# Altium project pay-optical-tls2591.PrjPCB (part 1 of 2)
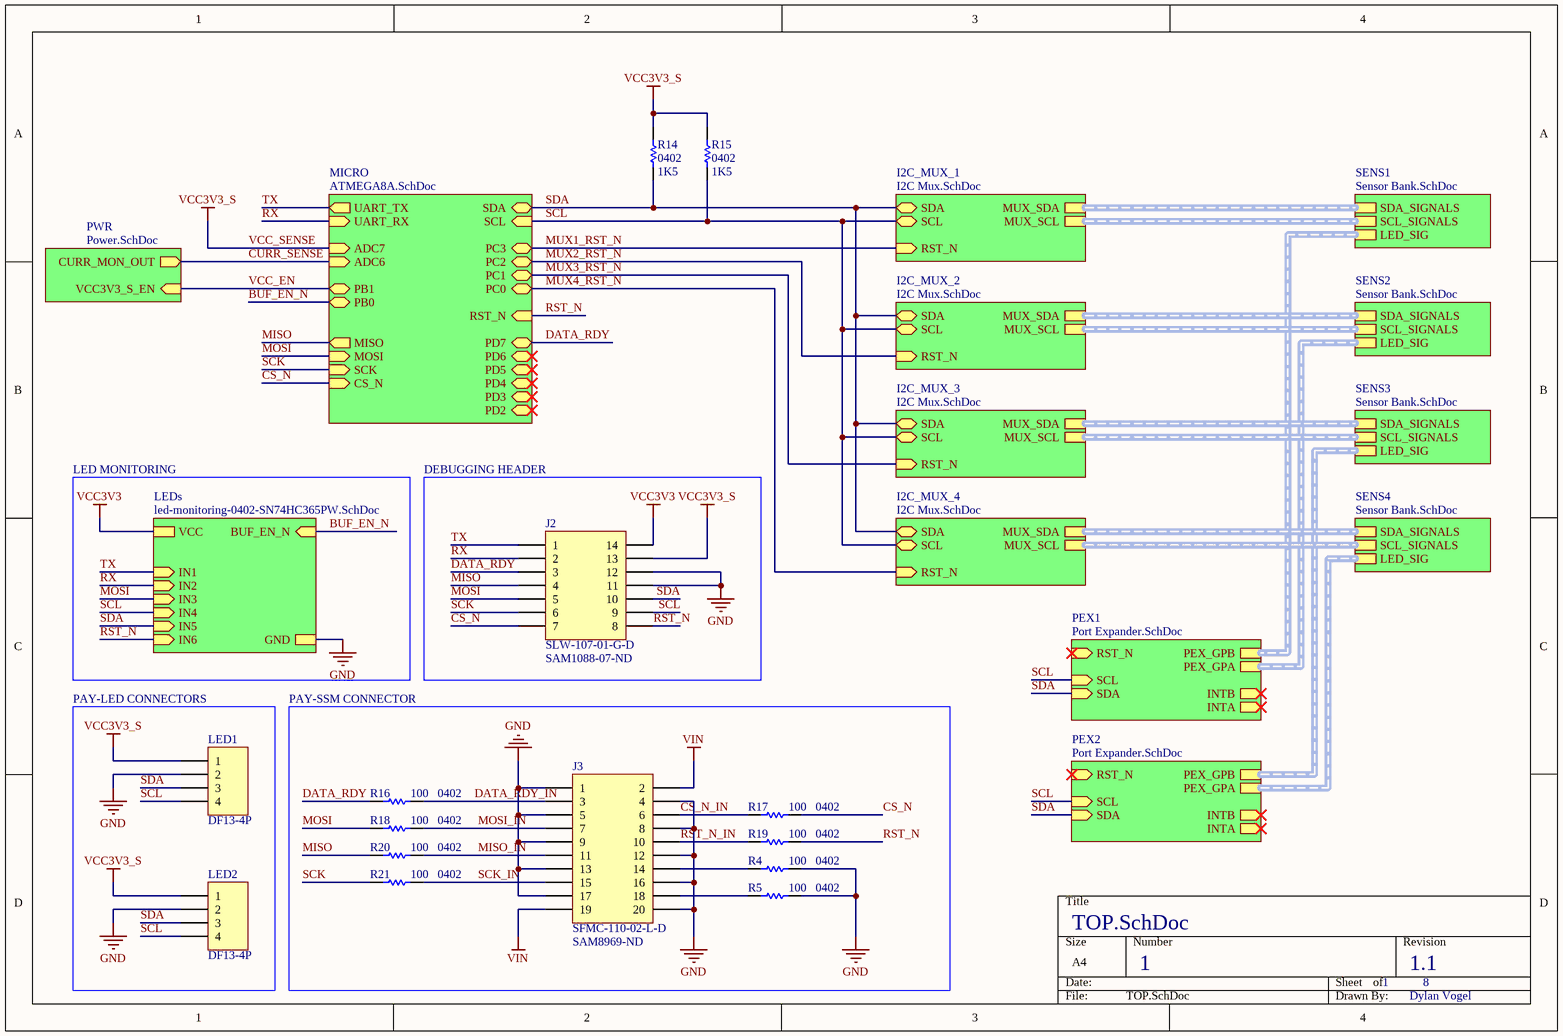
[diagram p0: TOP.SchDoc]
PROJ_AUTHOR: Dylan Vogel; PROJ_ORG: UTAT SS; PROJ_VERSION: 1.1
7 sheets, 325 parts. Net scope: hierarchical (ports join the sheet entries above them; power ports are global).
Board file: pay-optical-tls2591.PcbDoc
Sheets:
  TOP.SchDoc
    MICRO = ATMEGA8A.SchDoc
    PWR = Power.SchDoc
    SENS1 = Sensor Bank.SchDoc
      TSL2591_1 = TSL2591.SchDoc
      TSL2591_2 = TSL2591.SchDoc
      TSL2591_3 = TSL2591.SchDoc
      TSL2591_4 = TSL2591.SchDoc
      TSL2591_5 = TSL2591.SchDoc
      TSL2591_6 = TSL2591.SchDoc
      TSL2591_7 = TSL2591.SchDoc
      TSL2591_8 = TSL2591.SchDoc
    SENS2 = Sensor Bank.SchDoc
      TSL2591_1 = TSL2591.SchDoc
      TSL2591_2 = TSL2591.SchDoc
      TSL2591_3 = TSL2591.SchDoc
      TSL2591_4 = TSL2591.SchDoc
      TSL2591_5 = TSL2591.SchDoc
      TSL2591_6 = TSL2591.SchDoc
      TSL2591_7 = TSL2591.SchDoc
      TSL2591_8 = TSL2591.SchDoc
    SENS3 = Sensor Bank.SchDoc
      TSL2591_1 = TSL2591.SchDoc
      TSL2591_2 = TSL2591.SchDoc
      TSL2591_3 = TSL2591.SchDoc
      TSL2591_4 = TSL2591.SchDoc
      TSL2591_5 = TSL2591.SchDoc
      TSL2591_6 = TSL2591.SchDoc
      TSL2591_7 = TSL2591.SchDoc
      TSL2591_8 = TSL2591.SchDoc
    SENS4 = Sensor Bank.SchDoc
      TSL2591_1 = TSL2591.SchDoc
      TSL2591_2 = TSL2591.SchDoc
      TSL2591_3 = TSL2591.SchDoc
      TSL2591_4 = TSL2591.SchDoc
      TSL2591_5 = TSL2591.SchDoc
      TSL2591_6 = TSL2591.SchDoc
      TSL2591_7 = TSL2591.SchDoc
      TSL2591_8 = TSL2591.SchDoc
    PEX1 = Port Expander.SchDoc
    PEX2 = Port Expander.SchDoc
    I2C_MUX_1 = I2C Mux.SchDoc
    I2C_MUX_2 = I2C Mux.SchDoc
    I2C_MUX_3 = I2C Mux.SchDoc
    I2C_MUX_4 = I2C Mux.SchDoc

## Sheet TOP.SchDoc
size A4; DrawnBy: Dylan Vogel; Organization: UTAT SS; DocumentNumber: 1; Revision: 1.0; SheetNumber: 1; SheetTotal: 8

### Parts
J2  SLW-107-01-G-D  Supplier Part Number 1: SAM1088-07-ND  [SLW-107-01-X-D]
J3  SFMC-110-02-L-D  Supplier Part Number 1: SAM8969-ND  [SFMC-110-02-L-D]
LED1  DF13-4P  [DF13A-4P-1.25H(51)]
LED2  DF13-4P  [DF13A-4P-1.25H(51)]
R4  0402  value 100  [RES0402R]
R5  0402  value 100  [RES0402R]
R14  0402  value 1K5  [RES0402R]
R15  0402  value 1K5  [RES0402R]
R16  0402  value 100  [RES0402R]
R17  0402  value 100  [RES0402R]
R18  0402  value 100  [RES0402R]
R19  0402  value 100  [RES0402R]
R20  0402  value 100  [RES0402R]
R21  0402  value 100  [RES0402R]

### Blocks framed on the sheet
DEBUGGING HEADER: J2
PAY-LED CONNECTORS: LED1 LED2
PAY-SSM CONNECTOR: J3 R4 R5 R16-R21

### Sub-sheets
I2C_MUX_1 = I2C Mux.SchDoc: SDA (bidir), SCL (bidir), MUX_SCL (harness MUX_SCL), RST_N (in), MUX_SDA (harness MUX_SDA)  | ADDRESS: 0b000
I2C_MUX_2 = I2C Mux.SchDoc: SDA (bidir), SCL (bidir), MUX_SCL (harness MUX_SCL), RST_N (in), MUX_SDA (harness MUX_SDA)  | ADDRESS: 0b001
I2C_MUX_3 = I2C Mux.SchDoc: SDA (bidir), SCL (bidir), MUX_SCL (harness MUX_SCL), RST_N (in), MUX_SDA (harness MUX_SDA)  | ADDRESS: 0b010
I2C_MUX_4 = I2C Mux.SchDoc: SDA (bidir), SCL (bidir), MUX_SCL (harness MUX_SCL), RST_N (in), MUX_SDA (harness MUX_SDA)  | ADDRESS: 0b011
LEDs = led-monitoring-0402-SN74HC365PW.SchDoc (file not in this document): IN3 (in), IN6 (in), IN4 (in), IN5 (in), GND, VCC, BUF_EN_N (in), IN1 (in), IN2 (in)  | LED1: ORANGE; LED2: ORANGE; LED3: GREEN; LED4: BLUE; LED5: BLUE; LED6: GREEN
MICRO = ATMEGA8A.SchDoc: PC3 (bidir), PB1 (bidir), ADC7 (in), PB0 (bidir), PC0 (bidir), ADC6 (in), PC1 (bidir), MOSI (in), PD2 (bidir), PC2 (bidir), SDA (bidir), PD7 (bidir), PD4 (bidir), MISO (out), PD6 (bidir), UART_RX (in), SCL (in), CS_N (in), RST_N (in), PD5 (bidir), SCK (in), PD3 (bidir), UART_TX (out)
PEX1 = Port Expander.SchDoc: SDA (in), INTA (out), INTB (out), RST_N (in), SCL (in), PEX_GPB (harness PEX_GPB), PEX_GPA (harness PEX_GPA)  | ADDRESS: 0b001
PEX2 = Port Expander.SchDoc: SDA (in), INTA (out), INTB (out), RST_N (in), SCL (in), PEX_GPB (harness PEX_GPB), PEX_GPA (harness PEX_GPA)  | ADDRESS: 0b010
PWR = Power.SchDoc: VCC3V3_S_EN (in), CURR_MON_OUT (out)
SENS1 = Sensor Bank.SchDoc: LED_SIG (harness Harness), SCL_SIGNALS (harness MUX_SCL), SDA_SIGNALS (harness MUX_SDA)
SENS2 = Sensor Bank.SchDoc: LED_SIG (harness Harness), SCL_SIGNALS (harness MUX_SCL), SDA_SIGNALS (harness MUX_SDA)
SENS3 = Sensor Bank.SchDoc: LED_SIG (harness Harness), SCL_SIGNALS (harness MUX_SCL), SDA_SIGNALS (harness MUX_SDA)
SENS4 = Sensor Bank.SchDoc: SCL_SIGNALS (harness MUX_SCL), SDA_SIGNALS (harness MUX_SDA), LED_SIG (harness LED_SIG)

### Nets
GND: J2.6(12) J2.8(11) J3.1 J3.4 J3.5 J3.8 J3.9 J3.12 J3.13 J3.16 J3.17 J3.20 LED1.2 LED2.2 R4.2 R5.2 ; sheet LEDs/GND
VCC3V3: J2.2(14) ; sheet LEDs/VCC
VCC3V3_S: J2.4(13) LED1.1 LED2.1 R14.2 R15.2 ; sheet MICRO/ADC7  [also labelled VCC_SENSE]
VIN: J3.2 J3.19
BUF_EN_N: sheet MICRO/PB0, sheet LEDs/BUF_EN_N
CS_N: J2.13(7) R17.2 ; sheet MICRO/CS_N
CS_N_IN: J3.6 R17.1
CURR_SENSE: sheet MICRO/ADC6, sheet PWR/CURR_MON_OUT
DATA_RDY: J2.5(3) R16.1 ; sheet MICRO/PD7
DATA_RDY_IN: J3.3 R16.2
MISO: J2.7(4) R20.1 ; sheet MICRO/MISO
MISO_IN: J3.11 R20.2
MOSI: J2.9(5) R18.1 ; sheet MICRO/MOSI, sheet LEDs/IN3
MOSI_IN: J3.7 R18.2
MUX1_RST_N: sheet MICRO/PC3, sheet I2C_MUX_1/RST_N
MUX2_RST_N: sheet MICRO/PC2, sheet I2C_MUX_2/RST_N
MUX3_RST_N: sheet MICRO/PC1, sheet I2C_MUX_3/RST_N
MUX4_RST_N: sheet MICRO/PC0, sheet I2C_MUX_4/RST_N
RST_N: J2.14(8) R19.2 ; sheet MICRO/RST_N, sheet LEDs/IN6
RST_N_IN: J3.10 R19.1
RX: J2.3(2) ; sheet MICRO/UART_RX, sheet LEDs/IN2
SCK: J2.11(6) R21.1 ; sheet MICRO/SCK
SCK_IN: J3.15 R21.2
SCL: J2.12(9) LED1.4 LED2.4 R15.1 ; sheet MICRO/SCL, sheet LEDs/IN4, sheet PEX1/SCL, sheet PEX2/SCL, sheet I2C_MUX_1/SCL, sheet I2C_MUX_2/SCL, sheet I2C_MUX_3/SCL, sheet I2C_MUX_4/SCL
SDA: J2.10 LED1.3 LED2.3 R14.1 ; sheet MICRO/SDA, sheet LEDs/IN5, sheet PEX1/SDA, sheet PEX2/SDA, sheet I2C_MUX_1/SDA, sheet I2C_MUX_2/SDA, sheet I2C_MUX_3/SDA, sheet I2C_MUX_4/SDA
TX: J2.1 ; sheet MICRO/UART_TX, sheet LEDs/IN1
VCC_EN: sheet MICRO/PB1, sheet PWR/VCC3V3_S_EN
NetJ3_14: J3.14 R4.1
NetJ3_18: J3.18 R5.1

### Buses and harness runs
harness sheet I2C_MUX_1/MUX_SCL = sheet SENS1/SCL_SIGNALS
harness sheet I2C_MUX_1/MUX_SDA = sheet SENS1/SDA_SIGNALS
harness sheet I2C_MUX_2/MUX_SCL = sheet SENS2/SCL_SIGNALS
harness sheet I2C_MUX_2/MUX_SDA = sheet SENS2/SDA_SIGNALS
harness sheet I2C_MUX_3/MUX_SCL = sheet SENS3/SCL_SIGNALS
harness sheet I2C_MUX_3/MUX_SDA = sheet SENS3/SDA_SIGNALS
harness sheet I2C_MUX_4/MUX_SCL = sheet SENS4/SCL_SIGNALS
harness sheet I2C_MUX_4/MUX_SDA = sheet SENS4/SDA_SIGNALS
harness sheet PEX1/PEX_GPA = sheet SENS2/LED_SIG
harness sheet PEX1/PEX_GPB = sheet SENS1/LED_SIG
harness sheet PEX2/PEX_GPA = sheet SENS4/LED_SIG
harness sheet PEX2/PEX_GPB = sheet SENS3/LED_SIG

### Notes on the sheet
- LED MONITORING

### Library data of the parts
LED1 LED2 = Header 4: Header, 4-Pin; LatestRevisionDate: 17-Jul-2002; LatestRevisionNote: Re-released for DXP Platform.; Publisher: Altium Limited
R4 R5 R14-R21 = Res1: Resistor; Published: 8-Jun-2000; LatestRevisionDate: 17-Jul-2002; LatestRevisionNote: Re-released for DXP Platform.; PackageReference: AXIAL-0.3; Publisher: Altium Limited; PackageDescription: Axial Device, Thru-Hole; 2 Leads; 0.3 in Pin Spacing; Supplier 1: Digi-Key
J2 = SLW-107-01-G-D: Supplier 1: Digi-Key
J3 = SFMC-110-02-L-D: Supplier 1: Digi-Key

## Sheet ATMEGA8A.SchDoc
size A4; DocumentNumber: 2; SheetNumber: 2; SheetTotal: 8
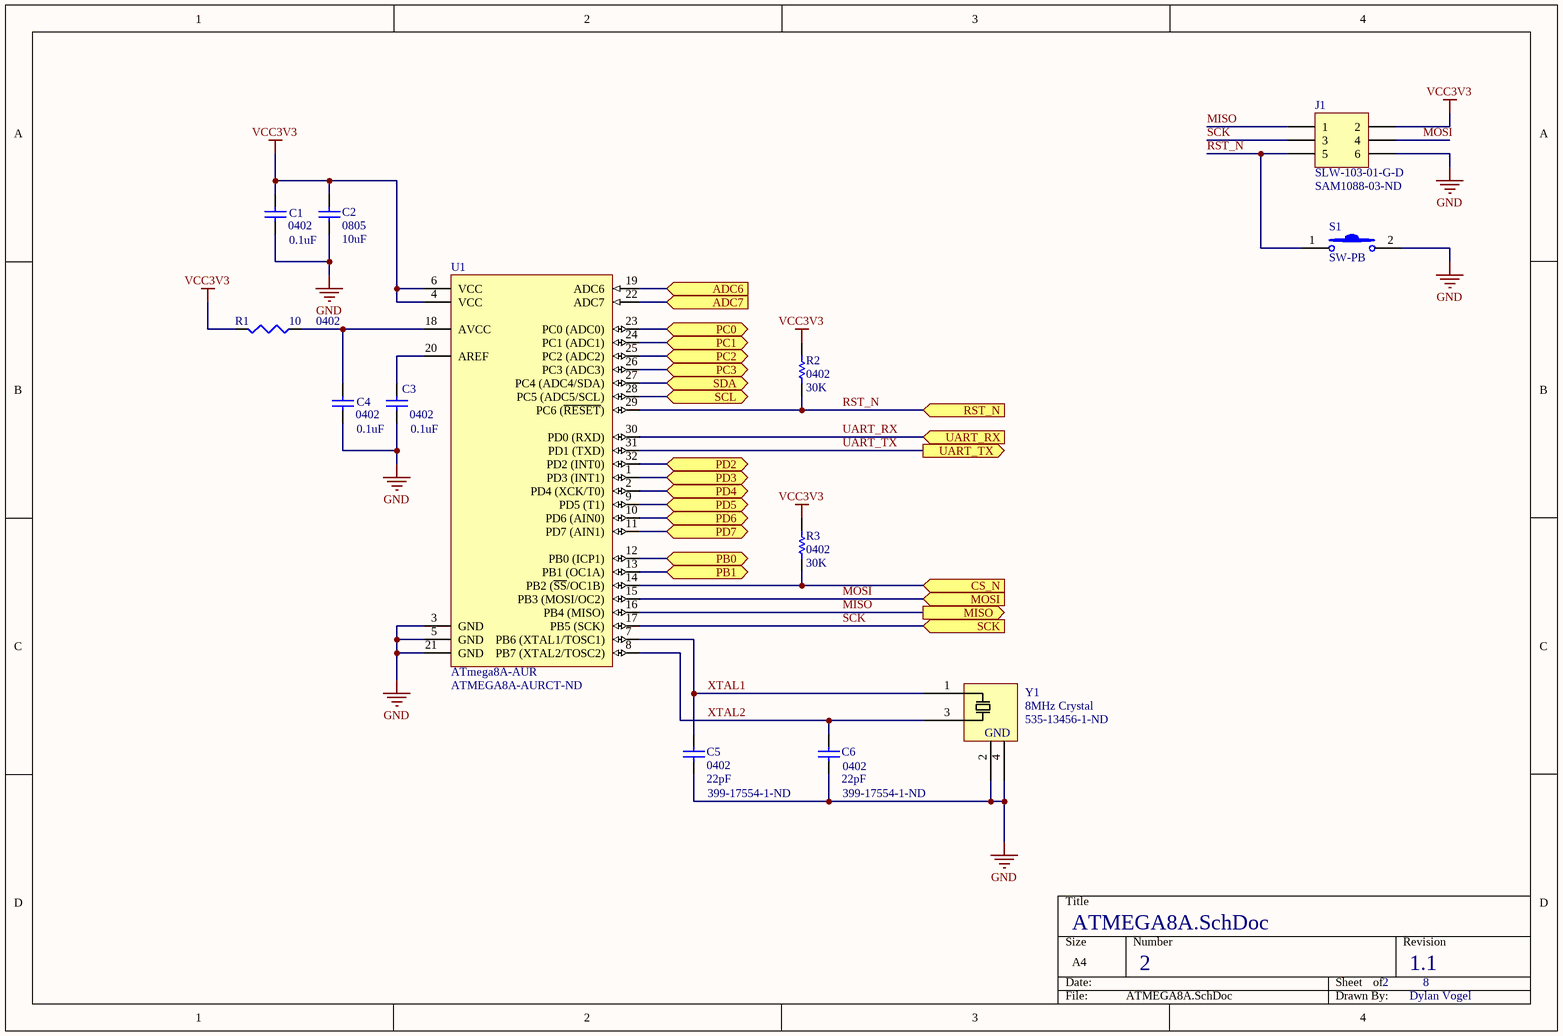
[diagram p1: ATMEGA8A.SchDoc]

### Parts
C1  0402  value 0.1uF  [CAP0402R]
C2  0805  value 10uF  [CAP0805R]
C3  0402  value 0.1uF  [CAP0402R]
C4  0402  value 0.1uF  [CAP0402R]
C5  0402  value 22pF  Supplier Part Number 1: 399-17554-1-ND  [CAP0402R]
C6  0402  value 22pF  Supplier Part Number 1: 399-17554-1-ND  [CAP0402R]
J1  SLW-103-01-G-D  Supplier Part Number 1: SAM1088-03-ND  [SLW-103-01-X-D]
R1  0402  value 10  [RES0402R]
R2  0402  value 30K  [RES0402R]
R3  0402  value 30K  [RES0402R]
S1  SW-PB  [PTS830GM140 SMTR LFS - Pushbutton]
U1  ATmega8A-AUR  Supplier Part Number 1: ATMEGA8A-AURCT-ND  [QFP80P900X900X120-32]
Y1  8MHz Crystal  Supplier Part Number 1: 535-13456-1-ND  [OSCSC500X320X110-4N]

### Ports
ADC6 (in), ADC7 (in), CS_N (in), MISO (out), MOSI (in), PB0 (bidir), PB1 (bidir), PC0 (bidir), PC1 (bidir), PC2 (bidir), PC3 (bidir), PD2 (bidir), PD3 (bidir), PD4 (bidir), PD5 (bidir), PD6 (bidir), PD7 (bidir), RST_N (in), SCK (in), SCL (bidir), SDA (bidir), UART_RX (in), UART_TX (out)

### Nets
GND: C1.1 C2.1 C3.1 C4.1 C5.1 C6.1 J1.6 S1.2 U1.3(GND) U1.5(GND) U1.21(GND) Y1.2 Y1.4
VCC3V3: C1.2 C2.2 J1.2 R1.2 R2.2 R3.2 U1.4(VCC) U1.6(VCC)
VCC3V3_S: U1.22(ADC7) ; port ADC7
BUF_EN_N: U1.12(PB0_(ICP1)) ; port PB0
CS_N: R3.1 U1.14(PB2_(~{SS}/OC1B)) ; port CS_N
CURR_SENSE: U1.19(ADC6) ; port ADC6
DATA_RDY: U1.11(PD7_(AIN1)) ; port PD7
MISO: J1.1 U1.16(PB4_(MISO)) ; port MISO
MOSI: J1.4 U1.15(PB3_(MOSI/OC2)) ; port MOSI
MUX1_RST_N: U1.26(PC3_(ADC3)) ; port PC3
MUX2_RST_N: U1.25(PC2_(ADC2)) ; port PC2
MUX3_RST_N: U1.24(PC1_(ADC1)) ; port PC1
MUX4_RST_N: U1.23(PC0_(ADC0)) ; port PC0
RST_N: J1.5 R2.1 S1.1 U1.29(PC6_(~{RESET})) ; port RST_N
SCK: J1.3 U1.17(PB5_(SCK)) ; port SCK
SCL: U1.28(PC5_(ADC5/SCL)) ; port SCL
SDA: U1.27(PC4_(ADC4/SDA)) ; port SDA
UART_RX: U1.30(PD0_(RXD)) ; port UART_RX  [project net RX]
UART_TX: U1.31(PD1_(TXD)) ; port UART_TX  [project net TX]
VCC_EN: U1.13(PB1_(OC1A)) ; port PB1
XTAL1: C5.2 U1.7(PB6_(XTAL1/TOSC1)) Y1.1(IN)
XTAL2: C6.2 U1.8(PB7_(XTAL2/TOSC2)) Y1.3(IN)
NetC3_2: C3.2 U1.20(AREF)
NetC4_2: C4.2 R1.1 U1.18(AVCC)
NetU1_1: U1.1(PD3_(INT1)) ; port PD3
NetU1_2: U1.2(PD4_(XCK/T0)) ; port PD4
NetU1_9: U1.9(PD5_(T1)) ; port PD5
NetU1_10: U1.10(PD6_(AIN0)) ; port PD6
NetU1_32: U1.32(PD2_(INT0)) ; port PD2

### Notes on the sheet
- (in symbol AMB3B-8MHz) GND

### Library data of the parts
C1 C3 C4 = Cap Semi: Capacitor (Semiconductor SIM Model); Manufacturer: Murata; Manufacturer Part Number: GCM155R71C104KA55J; Capacitance: 100nF; Tolerance: 10%; Voltage Rating: 16V; Dielectric: X7R; Published: 8-Jun-2000; LatestRevisionDate: 29-May-2009; LatestRevisionNote: IPC-7351 Footprint Added.; PackageReference: C1206; Publisher: Altium Limited; PackageDescription: Chip Capacitor; Supplier 1: Digi-Key; Supplier Part Number 1: 587-3807-1-ND; Supplier 2: Digi-Key; Supplier Part Number 2: 490-7998-1-ND; Stock 2: 5962647; Pricing 2: 1=0.1, 10=0.058, 100=0.026, 500=0.01858, 1000=0.0146, 2500=0.01328, 5000=0.01221 (USD); Mount: Surface Mount; Case/Package: 0402; Case Code (Imperial): 0402; Case Code (Metric): 1005; Min Operating Temperature: -55°C; Max Operating Temperature: 125°C; Voltage Rating (DC): 16V; Packaging: Tape and Reel; Package Quantity: 1; Termination: SMD/SMT; Length: 1mm; Height: 0.5mm; Width: 0.5mm; Thickness: 0.022inch; Depth: 0.5mm; Ratings: AEC-Q200; Radiation Hardening: No; Lead Free: Lead Free; ComponentLink1URL: http://psearch.murata.com/capacitor/product/GCM155R71C104KA55%23.pdf?src-supplier=Avnet; ComponentLink1Description: http://psearch.murata.com/capacitor/product/GCM155R71C104KA55%23.pdf?src-supplier=Avnet; ComponentLink2URL: http://www1.futureelectronics.com/doc/MURATA/GCM155R71C104KA55J.pdf?src-supplier=Future+Electronics; ComponentLink2Description: http://www1.futureelectronics.com/doc/MURATA/GCM155R71C104KA55J.pdf?src-supplier=Future+Electronics; ComponentLink3URL: http://psearch.en.murata.com/capacitor/product/GCM155R71C104KA55%23.pdf?src-supplier=Digi-Key; ComponentLink3Description: http://psearch.en.murata.com/capacitor/product/GCM155R71C104KA55%23.pdf?src-supplier=Digi-Key; ComponentLink4URL: http://search.murata.co.jp/Ceramy/image/img/A01X/partnumbering_e_02.pdf?src-supplier=Digi-Key; ComponentLink4Description: http://search.murata.co.jp/Ceramy/image/img/A01X/partnumbering_e_02.pdf?src-supplier=Digi-Key
  C3: Supplier 3: Digi-Key; Supplier Part Number 3: 399-17704-1-ND; Stock 3: 396535; Pricing 3: 1=0.17, 10=0.12, 100=0.0564, 500=0.03952, 1000=0.03273 (USD)
C2 = Cap: Capacitor; Manufacturer: TDK; Manufacturer Part Number: CGA4J1X7R0J106K125AC; Voltage Rating: 6.3V; Tolerance: 10%; Dielectric: X7R; Published: 8-Jun-2000; LatestRevisionDate: 17-Jul-2002; LatestRevisionNote: Re-released for DXP Platform.; PackageReference: RAD-0.3; Publisher: Altium Limited; PackageDescription: Radial Cap, Thru-Hole; 2 Leads; 0.3 in Pin Spacing; Supplier 1: Digi-Key; Supplier Part Number 1: 445-6971-1-ND; Stock 1: 793917; Pricing 1: 1=0.48, 10=0.331, 100=0.1984, 500=0.14878, 1000=0.12564 (USD); Mount: Surface Mount; Case/Package: 0805; Weight: 0.000194oz; Case Code (Metric): 2012; Case Code (Imperial): 0805; Min Operating Temperature: -55°C; Max Operating Temperature: 125°C; Package Quantity: 1; Capacitance: 10uF; Packaging: Tape and Reel; Voltage Rating (DC): 6.3V; Termination: SMD/SMT; Composition: Ceramic; Length: 2mm; Height: 1.25mm; Width: 0.049inch; Thickness: 0.057inch; Depth: 1.25mm; Ratings: AEC-Q200; REACH SVHC: No SVHC; Lead Free: Lead Free; ComponentLink1URL: http://www.farnell.com/datasheets/1807242.pdf?src-supplier=Element14; ComponentLink1Description: http://www.farnell.com/datasheets/1807242.pdf?src-supplier=Element14; ComponentLink2URL: http://product.tdk.com/capacitor/mlcc/detailed_information.php?lang=en&amp;ref=jp&amp;part_no=CGA4J1X7R0J106K125AC&src-supplier=Mouser; ComponentLink2Description: http://product.tdk.com/capacitor/mlcc/detailed_information.php?lang=en&amp;ref=jp&amp;part_no=CGA4J1X7R0J106K125AC&src-supplier=Mouser
C5 C6 = Cap: Capacitor; Manufacturer: KEMET; Manufacturer Part Number: C0402C220K4RAC7867; Tolerance: 10%; Voltage Rating: 16V; Published: 8-Jun-2000; LatestRevisionDate: 17-Jul-2002; LatestRevisionNote: Re-released for DXP Platform.; PackageReference: RAD-0.3; Publisher: Altium Limited; PackageDescription: Radial Cap, Thru-Hole; 2 Leads; 0.3 in Pin Spacing; Supplier 1: Digi-Key; Stock 1: 72125; Pricing 1: 1=0.19, 10=0.132, 100=0.062, 500=0.0435, 1000=0.03601, 2500=0.03351, 5000=0.03066 (USD); Mount: Surface Mount; Case/Package: 0402; Case Code (Imperial): 0402; Case Code (Metric): 1005; Min Operating Temperature: -55°C; Max Operating Temperature: 125°C; Packaging: Tape and Reel; Capacitance: 22pF
R1 = Res3: Resistor; Published: 8-Jun-2000; LatestRevisionDate: 29-May-2009; LatestRevisionNote: IPC-7351 Footprint Added.; PackageReference: J1-0603; Publisher: Altium Limited; PackageDescription: Chip Resistor; Supplier 1: Digi-Key
R2 R3 = Res1: Resistor; Published: 8-Jun-2000; LatestRevisionDate: 17-Jul-2002; LatestRevisionNote: Re-released for DXP Platform.; PackageReference: AXIAL-0.3; Publisher: Altium Limited; PackageDescription: Axial Device, Thru-Hole; 2 Leads; 0.3 in Pin Spacing; Supplier 1: Digi-Key
S1 = Pushbutton - Low Profile: Schematic symbol for a generic 2-pin pushbutton, OFF-mom.; Supplier 1: Digi-Key
U1 = ATMEGA8A-AUR: 8-bit AVR Microcontroller, 2.7-5.5V, 16MHz, 8KB Flash, 512 Bytes EEPROM, 1KB SRAM, 32-pin TQFP, Industrial Grade (-40°C to 85°C), Reel; ComponentLink1Description: Manufacturer URL; ComponentLink2Description: ATmega8A Datasheet; DatasheetVersion: revD, Feb-2011; ComponentLink3URL: http://www.atmel.com/dyn/resources/prod_documents/8159S.pdf; ComponentLink3Description: ATmega8A Summary; ComponentLink1URL: http://www.atmel.com/; Code_JEDEC: MS-026-ABA; PackageVersion: revC, Oct-2010; PackageDescription: 32-Lead, 7x7x1.0 mm Body, 0.8mm Lead Pitch, Thin Profile Plastic Quad Flat Package (TQFP); ComponentLink2URL: http://www.atmel.com/dyn/resources/prod_documents/doc8159.pdf; PackageReference: 32A; PartNumber: ATMEGA8A-AUR; Supplier 1: Digi-Key
Y1 = AMB3B-8MHz: 8MHz Abracom 4-pin crystal.; Supplier 1: Digi-Key
J1 = SLW-103-01-G-D: Supplier 1: Digi-Key

## Sheet Power.SchDoc
size A4; DocumentNumber: 3; SheetNumber: 3; SheetTotal: 8
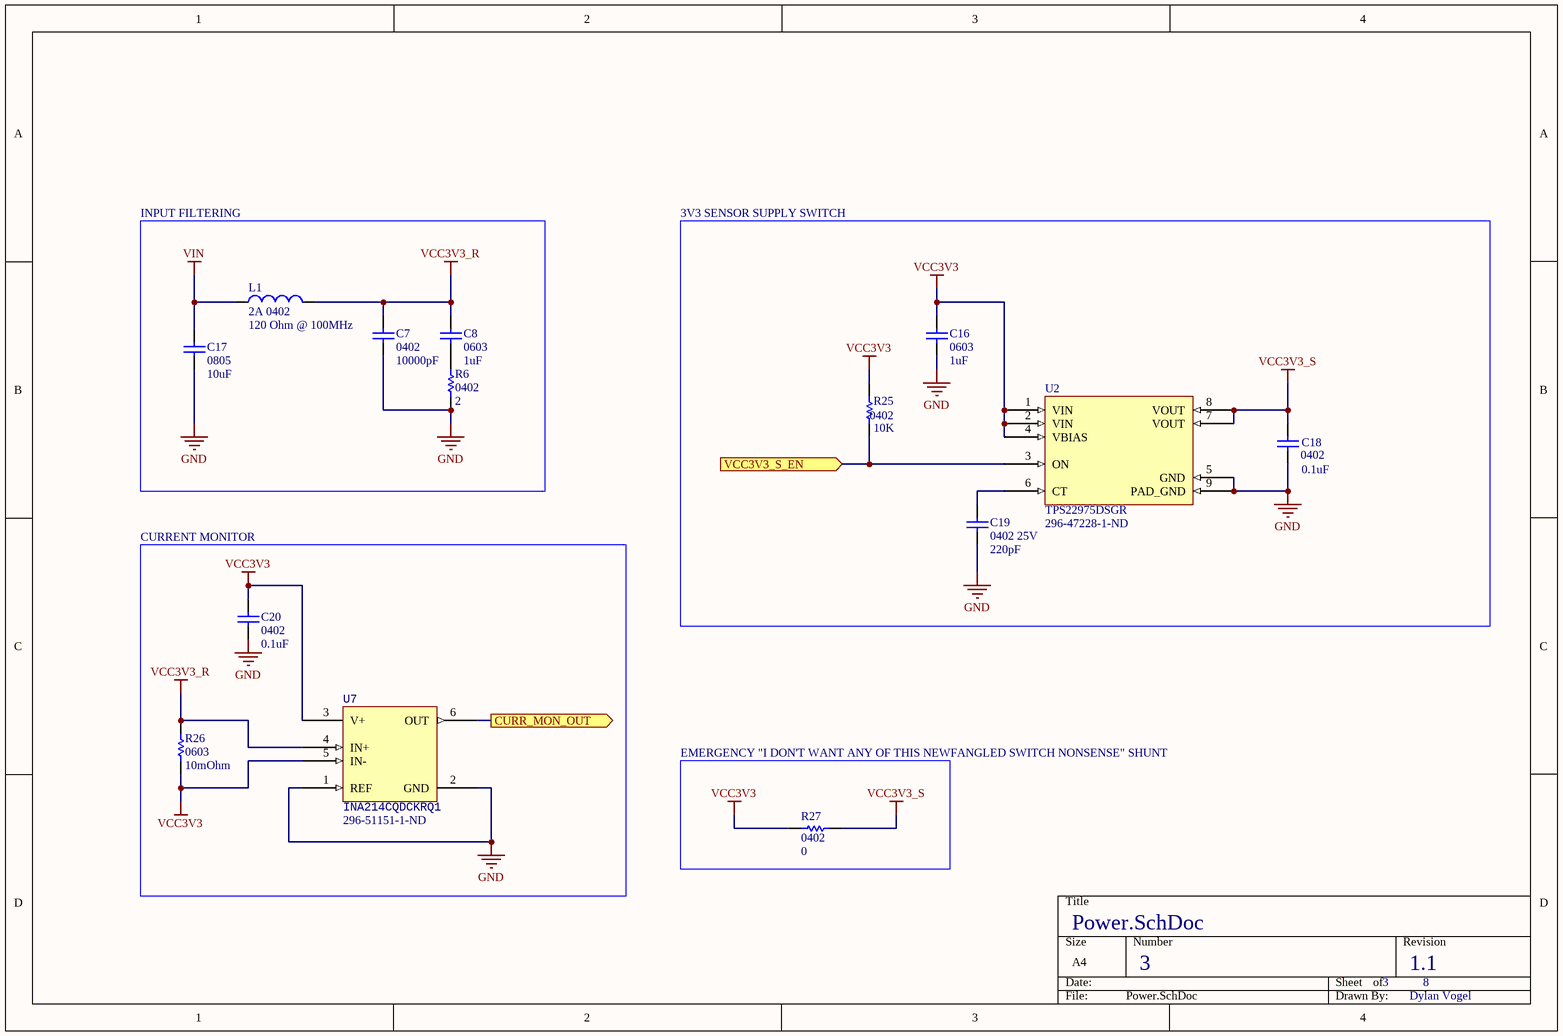
[diagram p2: Power.SchDoc]

### Parts
C7  0402  value 10000pF  [CAP0402R]
C8  0603  value 1uF  [CAP0603R]
C16  0603  value 1uF  [CAP0603R]
C17  0805  value 10uF  [CAP0805R]
C18  0402  value 0.1uF  [CAP0402R]
C19  0402 25V  value 220pF  [CAP0402R]
C20  0402  value 0.1uF  [CAP0402R]
L1  2A 0402  value 120 Ohm @ 100MHz  [RES0402R]
R6  0402  value 2  [RES0402R]
R25  0402  value 10K  [RES0402R]
R26  0603  value 10mOhm  [RES0603R]
R27  0402  value 0  [RES0402R]
U2  TPS22975DSGR  Supplier Part Number 1: 296-47228-1-ND  [DSG0008A]
U7  INA214CQDCKRQ1  Supplier Part Number 1: 296-51151-1-ND  [TI-SOT-SC70 (DCK)]

### Blocks framed on the sheet
INPUT FILTERING: C7 C8 C17 L1 R6
3V3 SENSOR SUPPLY SWITCH: C16 C18 C19 R25 U2
CURRENT MONITOR: C20 R26 U7

### Ports
CURR_MON_OUT (out), VCC3V3_S_EN (in)

### Nets
GND: C7.1 C16.1 C17.1 C18.1 C19.1 C20.2 R6.1 U2.5(GND) U2.9(PAD_GND) U7.1(REF) U7.2(GND)
VCC3V3: C16.2 C20.1 R25.2 R26.2 R27.2 U2.1(VIN) U2.2(VIN) U2.4(VBIAS) U7.3(V+) U7.5(IN-)
VCC3V3_R: C7.2 C8.2 L1.2 R26.1 U7.4(IN+)
VCC3V3_S: C18.2 R27.1 U2.7(VOUT) U2.8(VOUT)
VIN: C17.2 L1.1
CURR_SENSE: U7.6(OUT) ; port CURR_MON_OUT
VCC_EN: R25.1 U2.3(ON) ; port VCC3V3_S_EN
NetC8_1: C8.1 R6.2
NetC19_2: C19.2 U2.6(CT)

### Notes on the sheet
- EMERGENCY "I DON'T WANT ANY OF THIS NEWFANGLED SWITCH NONSENSE" SHUNT

### Library data of the parts
C7 C8 C16 C17 C20 = Cap: Capacitor; Published: 8-Jun-2000; LatestRevisionDate: 17-Jul-2002; LatestRevisionNote: Re-released for DXP Platform.; PackageReference: RAD-0.3; Publisher: Altium Limited; PackageDescription: Radial Cap, Thru-Hole; 2 Leads; 0.3 in Pin Spacing
C18 = Cap Semi: as C1 on sheet ATMEGA8A; Published: 8-Jun-2000; LatestRevisionDate: 29-May-2009; LatestRevisionNote: IPC-7351 Footprint Added.; PackageReference: C1206; Publisher: Altium Limited; PackageDescription: Chip Capacitor; Supplier 1: Digi-Key; Supplier Part Number 1: 587-3807-1-ND; Supplier 2: Digi-Key; Supplier Part Number 2: 490-7998-1-ND; Stock 2: 5962647; Pricing 2: 1=0.1, 10=0.058, 100=0.026, 500=0.01858, 1000=0.0146, 2500=0.01328, 5000=0.01221 (USD); Mount: Surface Mount; Case/Package: 0402; Case Code (Imperial): 0402; Case Code (Metric): 1005; Min Operating Temperature: -55°C; Max Operating Temperature: 125°C; Voltage Rating (DC): 16V; Packaging: Tape and Reel; Package Quantity: 1; Termination: SMD/SMT; Length: 1mm; Height: 0.5mm; Width: 0.5mm; Thickness: 0.022inch; Depth: 0.5mm; Ratings: AEC-Q200; Radiation Hardening: No; Lead Free: Lead Free; ComponentLink1URL: http://psearch.murata.com/capacitor/product/GCM155R71C104KA55%23.pdf?src-supplier=Avnet; ComponentLink1Description: http://psearch.murata.com/capacitor/product/GCM155R71C104KA55%23.pdf?src-supplier=Avnet; ComponentLink2URL: http://www1.futureelectronics.com/doc/MURATA/GCM155R71C104KA55J.pdf?src-supplier=Future+Electronics; ComponentLink2Description: http://www1.futureelectronics.com/doc/MURATA/GCM155R71C104KA55J.pdf?src-supplier=Future+Electronics; ComponentLink3URL: http://psearch.en.murata.com/capacitor/product/GCM155R71C104KA55%23.pdf?src-supplier=Digi-Key; ComponentLink3Description: http://psearch.en.murata.com/capacitor/product/GCM155R71C104KA55%23.pdf?src-supplier=Digi-Key; ComponentLink4URL: http://search.murata.co.jp/Ceramy/image/img/A01X/partnumbering_e_02.pdf?src-supplier=Digi-Key; ComponentLink4Description: http://search.murata.co.jp/Ceramy/image/img/A01X/partnumbering_e_02.pdf?src-supplier=Digi-Key
C19 = Cap: Capacitor; Manufacturer: Murata; Manufacturer Part Number: GCM155R71H221KA37D; Tolerance: 10%; Voltage Rating: 50V; Dielectric: X7R; Published: 8-Jun-2000; LatestRevisionDate: 17-Jul-2002; LatestRevisionNote: Re-released for DXP Platform.; PackageReference: RAD-0.3; Publisher: Altium Limited; PackageDescription: Radial Cap, Thru-Hole; 2 Leads; 0.3 in Pin Spacing; Supplier 1: Digi-Key; Supplier Part Number 1: 490-4912-1-ND; Stock 1: 43838; Pricing 1: 1=0.1, 10=0.059, 100=0.0264, 500=0.01884, 1000=0.0148, 2500=0.01346, 5000=0.01238 (USD); Mount: Surface Mount; Case/Package: 0402; Case Code (Imperial): 0402; Case Code (Metric): 1005; Min Operating Temperature: -55°C; Max Operating Temperature: 125°C; Capacitance: 220pF; Package Quantity: 1; Packaging: Tape and Reel; Termination: SMD/SMT; Voltage: 50V; Voltage Rating (DC): 50V; Length: 1mm; Height: 0.5mm; Width: 0.02inch; Thickness: 0.022inch; Depth: 0.5mm; Ratings: AEC-Q200; Radiation Hardening: No; ComponentLink1URL: http://psearch.murata.com/capacitor/product/GCM155R71H221KA37%23.pdf?src-supplier=Avnet+Europe; ComponentLink1Description: http://psearch.murata.com/capacitor/product/GCM155R71H221KA37%23.pdf?src-supplier=Avnet+Europe; ComponentLink2URL: http://search.murata.co.jp/Ceramy/image/img/A01X/partnumbering_e_02.pdf?src-supplier=Digi-Key; ComponentLink2Description: http://search.murata.co.jp/Ceramy/image/img/A01X/partnumbering_e_02.pdf?src-supplier=Digi-Key; ComponentLink3URL: https://www.murata.com/~/media/webrenewal/support/library/catalog/products/capacitor/mlcc/c03e.ashx?src-supplier=Avnet; ComponentLink3Description: https://www.murata.com/~/media/webrenewal/support/library/catalog/products/capacitor/mlcc/c03e.ashx?src-supplier=Avnet
L1 = Inductor: Manufacturer: Murata; Manufacturer Part Number: BLM15PX121SZ1D; Code_IEC: 1005; Number of Lines: 1; DC Resistance (DCR): 55mR; Published: 8-Jun-2000; LatestRevisionDate: 29-May-2009; LatestRevisionNote: IPC-7351 Footprint Added.; PackageReference: 0402-A; Publisher: Altium Limited; PackageDescription: Chip Inductor; Code_JEITA: 0402; Supplier 1: Digi-Key; Supplier Part Number 1: 490-16505-1-ND; Stock 1: 18936; Pricing 1: 1=0.15, 10=0.125, 25=0.0972, 50=0.0804, 100=0.0693, 250=0.05544, 500=0.0499, 1000=0.04158, 5000=0.03881 (USD); Mount: Surface Mount; Case/Package: 0402; Case Code (Imperial): 0402; Case Code (Metric): 1005; Min Operating Temperature: -55°C; Max Operating Temperature: 125°C; Packaging: Cut Tape; Max Current Rating: 2A; Ratings: AEC-Q200
R6 R25 R26 = Res1: Resistor; Published: 8-Jun-2000; LatestRevisionDate: 17-Jul-2002; LatestRevisionNote: Re-released for DXP Platform.; PackageReference: AXIAL-0.3; Publisher: Altium Limited; PackageDescription: Axial Device, Thru-Hole; 2 Leads; 0.3 in Pin Spacing
  R25: Supplier 1: Digi-Key
R27 = Res1: Resistor; Manufacturer: Panasonic; Manufacturer Part Number: ERJ2GE0R00X; Resistance: 0mR; Power Rating: 100mW; Voltage Rating: 50V; Tolerance: 5%; Temperature Coefficient: 600ppm/°C; Published: 8-Jun-2000; LatestRevisionDate: 17-Jul-2002; LatestRevisionNote: Re-released for DXP Platform.; PackageReference: AXIAL-0.3; Publisher: Altium Limited; PackageDescription: Axial Device, Thru-Hole; 2 Leads; 0.3 in Pin Spacing; Supplier 1: Digi-Key; Supplier 2: Digi-Key; Supplier Part Number 2: P0.0JCT-ND; Stock 2: 51531353; Pricing 2: 1=0.1, 10=0.03, 25=0.0216, 50=0.0164, 100=0.0121, 250=0.00924, 500=0.0074, 1000=0.00545, 5000=0.00391 (USD); Mount: Surface Mount; Case/Package: 0402; Case Code (Metric): 1005; Case Code (Imperial): 0402; Contact Plating: Tin; Min Operating Temperature: -55°C; Max Operating Temperature: 155°C; Packaging: Tape and Reel; Package Quantity: 1; Composition: Thick Film; Number of Terminations: 2; Termination: SMD/SMT; Military Standard: Not; Max Power Dissipation: 100mW; Voltage Rating (DC): 50V; Features: Automotive AEC-Q200; Length: 1mm; Height: 0.35mm; Width: 0.02inch; Depth: 0.5mm; Radiation Hardening: No; REACH SVHC: No SVHC; Lead Free: Lead Free; ComponentLink1URL: http://industrial.panasonic.com/www-data/pdf/AOA0000/AOA0000CE1.pdf?src-supplier=Avnet; ComponentLink1Description: http://industrial.panasonic.com/www-data/pdf/AOA0000/AOA0000CE1.pdf?src-supplier=Avnet; ComponentLink2URL: http://www.alliedelec.com/m/d/51cd0790071e1666bdb9d00c57fcf960.pdf?src-supplier=Allied+Electronics; ComponentLink2Description: http://www.alliedelec.com/m/d/51cd0790071e1666bdb9d00c57fcf960.pdf?src-supplier=Allied+Electronics; ComponentLink3URL: http://industrial.panasonic.com/www-data/pdf/AOA0000/AOA0000CE1.pdf?src-supplier=Avnet+Europe; ComponentLink3Description: http://industrial.panasonic.com/www-data/pdf/AOA0000/AOA0000CE1.pdf?src-supplier=Avnet+Europe; ComponentLink4URL: http://www.farnell.com/datasheets/2059623.pdf?src-supplier=Farnell; ComponentLink4Description: http://www.farnell.com/datasheets/2059623.pdf?src-supplier=Farnell; ComponentLink5URL: http://www.farnell.com/datasheets/1678796.pdf?src-supplier=Element14; ComponentLink5Description: http://www.farnell.com/datasheets/1678796.pdf?src-supplier=Element14; ComponentLink6URL: http://www.farnell.com/datasheets/2059623.pdf?src-supplier=Element14; ComponentLink6Description: http://www.farnell.com/datasheets/2059623.pdf?src-supplier=Element14
U2 = TPS22975DSGR: IC LOAD SWITCH N-CH 6A 8WSON; Supplier 1: Digi-Key; ComponentLink1Description: Datasheet; ComponentLink1URL: http://www.ti.com/general/docs/suppproductinfo.tsp?distId=10&gotoUrl=http%3A%2F%2Fwww.ti.com%2Flit%2Fgpn%2Ftps22975
U7 = INA214CQDCKRQ1: IC CURR SENSE 1 CIRCUIT SC70-6; Supplier 1: Digi-Key; ComponentLink1Description: Datasheet; ComponentLink1URL: http://www.ti.com/general/docs/suppproductinfo.tsp?distId=10&gotoUrl=http%3A%2F%2Fwww.ti.com%2Flit%2Fgpn%2Fina213-q1

## Sheet Sensor Bank.SchDoc
size A4; DocumentNumber: 6; SheetNumber: 6; SheetTotal: 8
Used 4 times, as channels SENS1, SENS2, SENS3, SENS4. Parts and nets are listed once, with the designators drawn on the sheet.
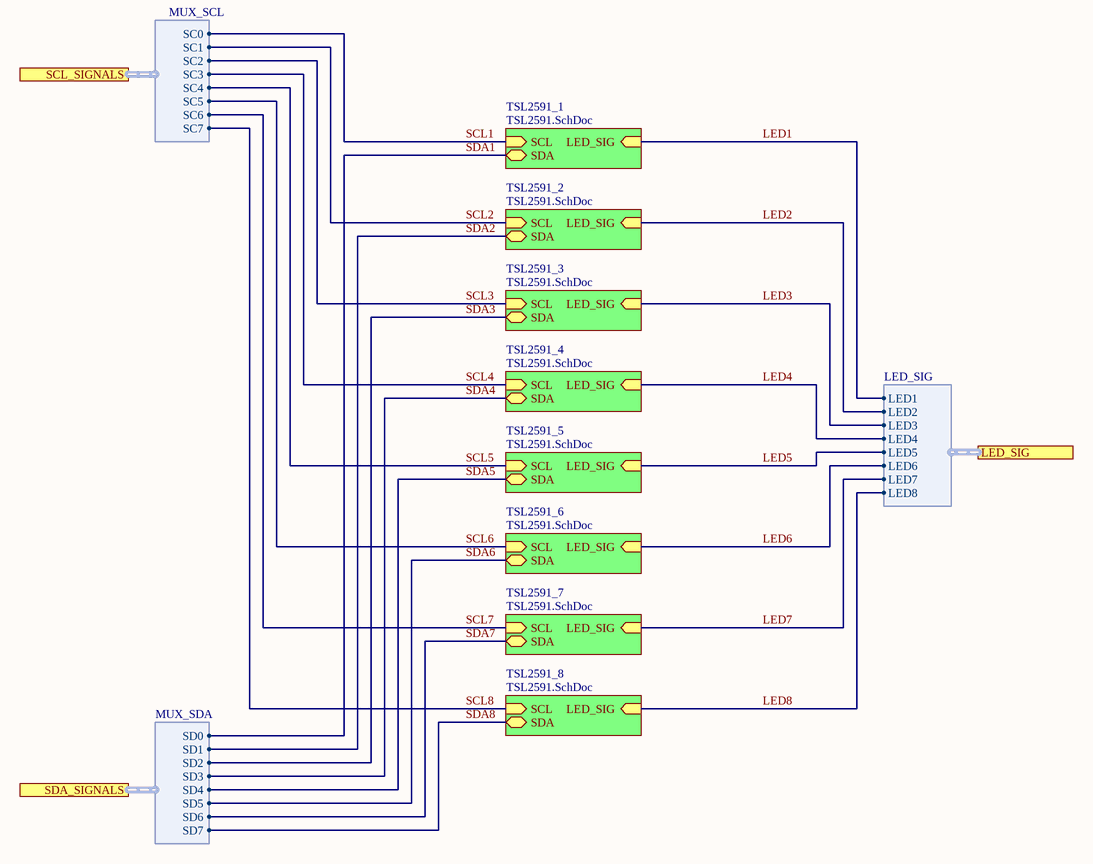
[diagram p3: Sensor Bank.SchDoc]

### Sub-sheets
TSL2591_1 = TSL2591.SchDoc: SCL (in), SDA (bidir), LED_SIG (in)
TSL2591_2 = TSL2591.SchDoc: SCL (in), SDA (bidir), LED_SIG (in)
TSL2591_3 = TSL2591.SchDoc: SCL (in), SDA (bidir), LED_SIG (in)
TSL2591_4 = TSL2591.SchDoc: SCL (in), SDA (bidir), LED_SIG (in)
TSL2591_5 = TSL2591.SchDoc: SCL (in), SDA (bidir), LED_SIG (in)
TSL2591_6 = TSL2591.SchDoc: SCL (in), SDA (bidir), LED_SIG (in)
TSL2591_7 = TSL2591.SchDoc: SCL (in), SDA (bidir), LED_SIG (in)
TSL2591_8 = TSL2591.SchDoc: SCL (in), SDA (bidir), LED_SIG (in)

### Ports
LED_SIG (harness LED_SIG), SCL_SIGNALS (harness MUX_SCL), SDA_SIGNALS (harness MUX_SDA)

### Harnesses
LED_SIG: LED1, LED2, LED3, LED4, LED5, LED6, LED7, LED8
MUX_SDA: SD0, SD1, SD2, SD3, SD4, SD5, SD6, SD7
MUX_SCL: SC0, SC1, SC2, SC3, SC4, SC5, SC6, SC7

### Nets
LED1: sheet TSL2591_1/LED_SIG, port LED_SIG.LED1
LED2: sheet TSL2591_2/LED_SIG, port LED_SIG.LED2
LED3: sheet TSL2591_3/LED_SIG, port LED_SIG.LED3
LED4: sheet TSL2591_4/LED_SIG, port LED_SIG.LED4
LED5: sheet TSL2591_5/LED_SIG, port LED_SIG.LED5
LED6: sheet TSL2591_6/LED_SIG, port LED_SIG.LED6
LED7: sheet TSL2591_7/LED_SIG, port LED_SIG.LED7
LED8: sheet TSL2591_8/LED_SIG, port LED_SIG.LED8
SCL1: sheet TSL2591_1/SCL, port SCL_SIGNALS.SC0
SCL2: sheet TSL2591_2/SCL, port SCL_SIGNALS.SC1
SCL3: sheet TSL2591_3/SCL, port SCL_SIGNALS.SC2
SCL4: sheet TSL2591_4/SCL, port SCL_SIGNALS.SC3
SCL5: sheet TSL2591_5/SCL, port SCL_SIGNALS.SC4
SCL6: sheet TSL2591_6/SCL, port SCL_SIGNALS.SC5
SCL7: sheet TSL2591_7/SCL, port SCL_SIGNALS.SC6
SCL8: sheet TSL2591_8/SCL, port SCL_SIGNALS.SC7
SDA1: sheet TSL2591_1/SDA, port SDA_SIGNALS.SD0
SDA2: sheet TSL2591_2/SDA, port SDA_SIGNALS.SD1
SDA3: sheet TSL2591_3/SDA, port SDA_SIGNALS.SD2
SDA4: sheet TSL2591_4/SDA, port SDA_SIGNALS.SD3
SDA5: sheet TSL2591_5/SDA, port SDA_SIGNALS.SD4
SDA6: sheet TSL2591_6/SDA, port SDA_SIGNALS.SD5
SDA7: sheet TSL2591_7/SDA, port SDA_SIGNALS.SD6
SDA8: sheet TSL2591_8/SDA, port SDA_SIGNALS.SD7

### Channels
SENS1: no parts or ports
SENS2: no parts or ports
SENS3: no parts or ports
SENS4: no parts or ports

## Sheet TSL2591.SchDoc
size A4; DocumentNumber: 7; SheetNumber: 7; SheetTotal: 8
Used 32 times, as channels SENS1/TSL2591_1, SENS1/TSL2591_2, SENS1/TSL2591_3, SENS1/TSL2591_4, SENS1/TSL2591_5, SENS1/TSL2591_6, SENS1/TSL2591_7, SENS1/TSL2591_8, SENS2/TSL2591_1, SENS2/TSL2591_2, SENS2/TSL2591_3, SENS2/TSL2591_4, SENS2/TSL2591_5, SENS2/TSL2591_6, SENS2/TSL2591_7, SENS2/TSL2591_8, SENS3/TSL2591_1, SENS3/TSL2591_2, SENS3/TSL2591_3, SENS3/TSL2591_4, SENS3/TSL2591_5, SENS3/TSL2591_6, SENS3/TSL2591_7, SENS3/TSL2591_8, SENS4/TSL2591_1, SENS4/TSL2591_2, SENS4/TSL2591_3, SENS4/TSL2591_4, SENS4/TSL2591_5, SENS4/TSL2591_6, SENS4/TSL2591_7, SENS4/TSL2591_8. Parts and nets are listed once, with the designators drawn on the sheet.
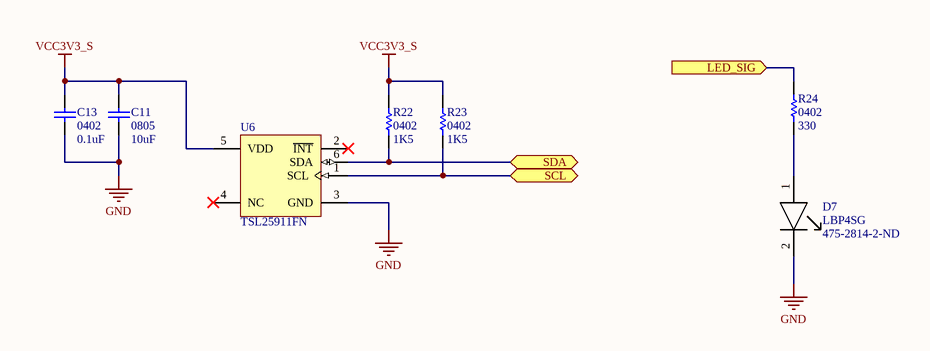
[diagram p4: TSL2591.SchDoc]

### Parts
C11  0805  value 10uF  [CAP0805R]
C13  0402  value 0.1uF  [CAP0402R]
D7  LBP4SG  Supplier Part Number 1: 475-2814-2-ND  [LB P4SG]
R22  0402  value 1K5  [RES0402R]
R23  0402  value 1K5  [RES0402R]
R24  0402  value 330  [RES0402R]
U6  TSL25911FN  [AMS-FN-6-2400X2000DE_V]

### Ports
LED_SIG (in), SCL (bidir), SDA (bidir)

### Nets
GND: C11.1 C13.1 D7.2(Cathode) U6.3(GND)
VCC3V3_S: C11.2 C13.2 R22.2 R23.2 U6.5(VDD)
LED_SIG: R24.1 ; port LED_SIG
SCL: R23.1 U6.1(SCL) ; port SCL
SDA: R22.1 U6.6(SDA) ; port SDA
NetD7_1: D7.1(Anode) R24.2

Not connected (* = marked no-connect by the designer): U6 2(~{INT})* 4(NC)*

### Channels
SENS1/TSL2591_1: designators end in _SENS1_TSL2591_1; ports LED_SIG=LED1 SCL=SCL0 SDA=SDA0
SENS1/TSL2591_2: designators end in _SENS1_TSL2591_2; ports LED_SIG=LED2 SCL=SCL1 SDA=SDA1
SENS1/TSL2591_3: designators end in _SENS1_TSL2591_3; ports LED_SIG=LED3 SCL=SCL2 SDA=SDA2
SENS1/TSL2591_4: designators end in _SENS1_TSL2591_4; ports LED_SIG=LED4 SCL=SCL3 SDA=SDA3
SENS1/TSL2591_5: designators end in _SENS1_TSL2591_5; ports LED_SIG=LED5 SCL=SCL4 SDA=SDA4
SENS1/TSL2591_6: designators end in _SENS1_TSL2591_6; ports LED_SIG=LED6 SCL=SCL5 SDA=SDA5
SENS1/TSL2591_7: designators end in _SENS1_TSL2591_7; ports LED_SIG=LED7 SCL=SCL6 SDA=SDA6
SENS1/TSL2591_8: designators end in _SENS1_TSL2591_8; ports LED_SIG=LED8 SCL=SCL7 SDA=SDA7
SENS2/TSL2591_1: designators end in _SENS2_TSL2591_1; ports LED_SIG=LED1 SCL=SCL0 SDA=SDA0
SENS2/TSL2591_2: designators end in _SENS2_TSL2591_2; ports LED_SIG=LED2 SCL=SCL1 SDA=SDA1
SENS2/TSL2591_3: designators end in _SENS2_TSL2591_3; ports LED_SIG=LED3 SCL=SCL2 SDA=SDA2
SENS2/TSL2591_4: designators end in _SENS2_TSL2591_4; ports LED_SIG=LED4 SCL=SCL3 SDA=SDA3
SENS2/TSL2591_5: designators end in _SENS2_TSL2591_5; ports LED_SIG=LED5 SCL=SCL4 SDA=SDA4
SENS2/TSL2591_6: designators end in _SENS2_TSL2591_6; ports LED_SIG=LED6 SCL=SCL5 SDA=SDA5
SENS2/TSL2591_7: designators end in _SENS2_TSL2591_7; ports LED_SIG=LED7 SCL=SCL6 SDA=SDA6
SENS2/TSL2591_8: designators end in _SENS2_TSL2591_8; ports LED_SIG=LED8 SCL=SCL7 SDA=SDA7
SENS3/TSL2591_1: designators end in _SENS3_TSL2591_1; ports LED_SIG=LED1 SCL=SCL0 SDA=SDA0
SENS3/TSL2591_2: designators end in _SENS3_TSL2591_2; ports LED_SIG=LED2 SCL=SCL1 SDA=SDA1
SENS3/TSL2591_3: designators end in _SENS3_TSL2591_3; ports LED_SIG=LED3 SCL=SCL2 SDA=SDA2
SENS3/TSL2591_4: designators end in _SENS3_TSL2591_4; ports LED_SIG=LED4 SCL=SCL3 SDA=SDA3
SENS3/TSL2591_5: designators end in _SENS3_TSL2591_5; ports LED_SIG=LED5 SCL=SCL4 SDA=SDA4
SENS3/TSL2591_6: designators end in _SENS3_TSL2591_6; ports LED_SIG=LED6 SCL=SCL5 SDA=SDA5
SENS3/TSL2591_7: designators end in _SENS3_TSL2591_7; ports LED_SIG=LED7 SCL=SCL6 SDA=SDA6
SENS3/TSL2591_8: designators end in _SENS3_TSL2591_8; ports LED_SIG=LED8 SCL=SCL7 SDA=SDA7
SENS4/TSL2591_1: designators end in _SENS4_TSL2591_1; ports LED_SIG=LED1 SCL=SCL0 SDA=SDA0
SENS4/TSL2591_2: designators end in _SENS4_TSL2591_2; ports LED_SIG=LED2 SCL=SCL1 SDA=SDA1
SENS4/TSL2591_3: designators end in _SENS4_TSL2591_3; ports LED_SIG=LED3 SCL=SCL2 SDA=SDA2
SENS4/TSL2591_4: designators end in _SENS4_TSL2591_4; ports LED_SIG=LED4 SCL=SCL3 SDA=SDA3
SENS4/TSL2591_5: designators end in _SENS4_TSL2591_5; ports LED_SIG=LED5 SCL=SCL4 SDA=SDA4
SENS4/TSL2591_6: designators end in _SENS4_TSL2591_6; ports LED_SIG=LED6 SCL=SCL5 SDA=SDA5
SENS4/TSL2591_7: designators end in _SENS4_TSL2591_7; ports LED_SIG=LED7 SCL=SCL6 SDA=SDA6
SENS4/TSL2591_8: designators end in _SENS4_TSL2591_8; ports LED_SIG=LED8 SCL=SCL7 SDA=SDA7

### Library data of the parts
C11 = Cap: as C2 on sheet ATMEGA8A; Published: 8-Jun-2000; LatestRevisionDate: 17-Jul-2002; LatestRevisionNote: Re-released for DXP Platform.; PackageReference: RAD-0.3; Publisher: Altium Limited; PackageDescription: Radial Cap, Thru-Hole; 2 Leads; 0.3 in Pin Spacing; Supplier 1: Digi-Key; Supplier Part Number 1: 445-6971-1-ND; Stock 1: 793917; Pricing 1: 1=0.48, 10=0.331, 100=0.1984, 500=0.14878, 1000=0.12564 (USD); Mount: Surface Mount; Case/Package: 0805; Weight: 0.000194oz; Case Code (Metric): 2012; Case Code (Imperial): 0805; Min Operating Temperature: -55°C; Max Operating Temperature: 125°C; Package Quantity: 1; Capacitance: 10uF; Packaging: Tape and Reel; Voltage Rating (DC): 6.3V; Termination: SMD/SMT; Composition: Ceramic; Length: 2mm; Height: 1.25mm; Width: 0.049inch; Thickness: 0.057inch; Depth: 1.25mm; Ratings: AEC-Q200; REACH SVHC: No SVHC; Lead Free: Lead Free; ComponentLink1URL: http://www.farnell.com/datasheets/1807242.pdf?src-supplier=Element14; ComponentLink1Description: http://www.farnell.com/datasheets/1807242.pdf?src-supplier=Element14; ComponentLink2URL: http://product.tdk.com/capacitor/mlcc/detailed_information.php?lang=en&amp;ref=jp&amp;part_no=CGA4J1X7R0J106K125AC&src-supplier=Mouser; ComponentLink2Description: http://product.tdk.com/capacitor/mlcc/detailed_information.php?lang=en&amp;ref=jp&amp;part_no=CGA4J1X7R0J106K125AC&src-supplier=Mouser
C13 = Cap: Capacitor; Manufacturer: Murata; Manufacturer Part Number: GCM155R71C104KA55J; Capacitance: 100nF; Tolerance: 10%; Voltage Rating: 16V; Dielectric: X7R; Published: 8-Jun-2000; LatestRevisionDate: 17-Jul-2002; LatestRevisionNote: Re-released for DXP Platform.; PackageReference: RAD-0.3; Publisher: Altium Limited; PackageDescription: Radial Cap, Thru-Hole; 2 Leads; 0.3 in Pin Spacing; Supplier 1: Digi-Key; Supplier 2: Digi-Key; Supplier Part Number 2: 490-7998-1-ND; Stock 2: 5962647; Pricing 2: 1=0.1, 10=0.058, 100=0.026, 500=0.01858, 1000=0.0146, 2500=0.01328, 5000=0.01221 (USD); Mount: Surface Mount; Case/Package: 0402; Case Code (Imperial): 0402; Case Code (Metric): 1005; Min Operating Temperature: -55°C; Max Operating Temperature: 125°C; Voltage Rating (DC): 16V; Packaging: Tape and Reel; Package Quantity: 1; Termination: SMD/SMT; Length: 1mm; Height: 0.5mm; Width: 0.5mm; Thickness: 0.022inch; Depth: 0.5mm; Ratings: AEC-Q200; Radiation Hardening: No; Lead Free: Lead Free; ComponentLink1URL: http://psearch.murata.com/capacitor/product/GCM155R71C104KA55%23.pdf?src-supplier=Avnet; ComponentLink1Description: http://psearch.murata.com/capacitor/product/GCM155R71C104KA55%23.pdf?src-supplier=Avnet; ComponentLink2URL: http://www1.futureelectronics.com/doc/MURATA/GCM155R71C104KA55J.pdf?src-supplier=Future+Electronics; ComponentLink2Description: http://www1.futureelectronics.com/doc/MURATA/GCM155R71C104KA55J.pdf?src-supplier=Future+Electronics; ComponentLink3URL: http://psearch.en.murata.com/capacitor/product/GCM155R71C104KA55%23.pdf?src-supplier=Digi-Key; ComponentLink3Description: http://psearch.en.murata.com/capacitor/product/GCM155R71C104KA55%23.pdf?src-supplier=Digi-Key; ComponentLink4URL: http://search.murata.co.jp/Ceramy/image/img/A01X/partnumbering_e_02.pdf?src-supplier=Digi-Key; ComponentLink4Description: http://search.murata.co.jp/Ceramy/image/img/A01X/partnumbering_e_02.pdf?src-supplier=Digi-Key
D7 = LB P4SG: LED BLUE CLEAR SMD BOTTOM ENTRY; Supplier 1: Digi-Key
R22-R24 = Res1: Resistor; Published: 8-Jun-2000; LatestRevisionDate: 17-Jul-2002; LatestRevisionNote: Re-released for DXP Platform.; PackageReference: AXIAL-0.3; Publisher: Altium Limited; PackageDescription: Axial Device, Thru-Hole; 2 Leads; 0.3 in Pin Spacing; Supplier 1: Digi-Key
U6 = TSL25911FN: Light-to-Digital Converter with I2C Interface, 2.7 to 3.6 V, -30 to 70 degC, FN-6, Pb-Free, Reel; Manufacturer: AMS; Supply Voltage (V): 2.7 - 3.6; Maximum Lux: 88K; Interface: I2C - Vdd; Programmable: Gain, Integration Time, Interrupt; ComponentLink1Description: Manufacturer URL; ComponentLink2Description: Datasheet; Mounting Technology: Surface Mount; ComponentLink1URL: www.ams.com; PackageVersion: TAOS059Q, 11/2009; PartNumber: TSL25911FN; PackageReference: FN-6; PackageDescription: 6-Pin Dual Flat No-Lead, 2.4 x 2 mm Body, 0.65 mm Pitch; ComponentLink2URL: http://www.ams.com/eng/content/download/389383/1251117/221235

## Sheet Port Expander.SchDoc
size A4; DocumentNumber: 5; SheetNumber: 5; SheetTotal: 8
Used 2 times, as channels PEX1, PEX2. Parts and nets are listed once, with the designators drawn on the sheet.
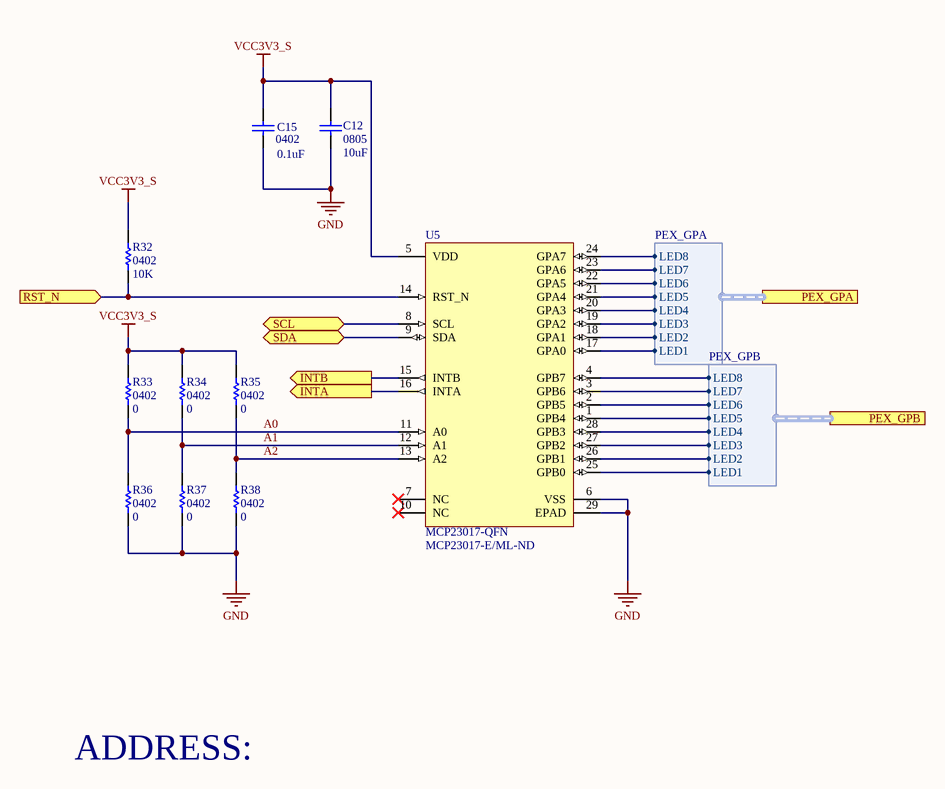
[diagram p5: Port Expander.SchDoc]

### Parts
C12  0805  value 10uF  [CAP0805R]
C15  0402  value 0.1uF  [CAP0402R]
R32  0402  value 10K  [RES0402R]
R33  0402  value 0  [RES0402R]
R34  0402  value 0  [RES0402R]
R35  0402  value 0  [RES0402R]
R36  0402  value 0  [RES0402R]
R37  0402  value 0  [RES0402R]
R38  0402  value 0  [RES0402R]
U5  MCP23017-QFN  Supplier Part Number 1: MCP23017-E/ML-ND  [QFN65P600X600X100-29]

### Ports
INTA (out), INTB (out), PEX_GPA (harness PEX_GPA), PEX_GPB (harness PEX_GPB), RST_N (in), SCL (bidir), SDA (bidir)

### Harnesses
PEX_GPA: LED1, LED2, LED3, LED4, LED5, LED6, LED7, LED8
PEX_GPB: LED1, LED2, LED3, LED4, LED5, LED6, LED7, LED8

### Nets
GND: C12.1 C15.1 R36.1 R37.1 R38.1 U5.6(VSS) U5.29(EPAD)
VCC3V3_S: C12.2 C15.2 R32.2 R33.2 R34.2 R35.2 U5.5(VDD)
A0: R33.1 R36.2 U5.11(A0)
A1: R34.1 R37.2 U5.12(A1)
A2: R35.1 R38.2 U5.13(A2)
INTA: U5.16(INTA) ; port INTA
INTB: U5.15(INTB) ; port INTB
RST_N: R32.1 U5.14(RST_N) ; port RST_N
SCL: U5.8(SCL) ; port SCL
SDA: U5.9(SDA) ; port SDA
NetU5_1: U5.1(GPB4) ; port PEX_GPB.LED5
NetU5_2: U5.2(GPB5) ; port PEX_GPB.LED6
NetU5_3: U5.3(GPB6) ; port PEX_GPB.LED7
NetU5_4: U5.4(GPB7) ; port PEX_GPB.LED8
NetU5_17: U5.17(GPA0) ; port PEX_GPA.LED1
NetU5_18: U5.18(GPA1) ; port PEX_GPA.LED2
NetU5_19: U5.19(GPA2) ; port PEX_GPA.LED3
NetU5_20: U5.20(GPA3) ; port PEX_GPA.LED4
NetU5_21: U5.21(GPA4) ; port PEX_GPA.LED5
NetU5_22: U5.22(GPA5) ; port PEX_GPA.LED6
NetU5_23: U5.23(GPA6) ; port PEX_GPA.LED7
NetU5_24: U5.24(GPA7) ; port PEX_GPA.LED8
NetU5_25: U5.25(GPB0) ; port PEX_GPB.LED1
NetU5_26: U5.26(GPB1) ; port PEX_GPB.LED2
NetU5_27: U5.27(GPB2) ; port PEX_GPB.LED3
NetU5_28: U5.28(GPB3) ; port PEX_GPB.LED4

Not connected (* = marked no-connect by the designer): U5 7(NC)* 10(NC)*

### Channels
PEX1: designators end in _PEX1; ports INTA=NetU5_PEX1_16 INTB=NetU5_PEX1_15 RST_N=NetR32_PEX1_1 SCL=SCL SDA=SDA
PEX2: designators end in _PEX2; ports INTA=NetU5_PEX2_16 INTB=NetU5_PEX2_15 RST_N=NetR32_PEX2_1 SCL=SCL SDA=SDA

### Notes on the sheet
- ADDRESS:

### Library data of the parts
C12 = Cap: as C2 on sheet ATMEGA8A; Published: 8-Jun-2000; LatestRevisionDate: 17-Jul-2002; LatestRevisionNote: Re-released for DXP Platform.; PackageReference: RAD-0.3; Publisher: Altium Limited; PackageDescription: Radial Cap, Thru-Hole; 2 Leads; 0.3 in Pin Spacing; Supplier 1: Digi-Key; Supplier Part Number 1: 445-6971-1-ND; Stock 1: 793917; Pricing 1: 1=0.48, 10=0.331, 100=0.1984, 500=0.14878, 1000=0.12564 (USD); Mount: Surface Mount; Case/Package: 0805; Weight: 0.000194oz; Case Code (Metric): 2012; Case Code (Imperial): 0805; Min Operating Temperature: -55°C; Max Operating Temperature: 125°C; Package Quantity: 1; Capacitance: 10uF; Packaging: Tape and Reel; Voltage Rating (DC): 6.3V; Termination: SMD/SMT; Composition: Ceramic; Length: 2mm; Height: 1.25mm; Width: 0.049inch; Thickness: 0.057inch; Depth: 1.25mm; Ratings: AEC-Q200; REACH SVHC: No SVHC; Lead Free: Lead Free; ComponentLink1URL: http://www.farnell.com/datasheets/1807242.pdf?src-supplier=Element14; ComponentLink1Description: http://www.farnell.com/datasheets/1807242.pdf?src-supplier=Element14; ComponentLink2URL: http://product.tdk.com/capacitor/mlcc/detailed_information.php?lang=en&amp;ref=jp&amp;part_no=CGA4J1X7R0J106K125AC&src-supplier=Mouser; ComponentLink2Description: http://product.tdk.com/capacitor/mlcc/detailed_information.php?lang=en&amp;ref=jp&amp;part_no=CGA4J1X7R0J106K125AC&src-supplier=Mouser
C15 = Cap Semi: as C1 on sheet ATMEGA8A; Published: 8-Jun-2000; LatestRevisionDate: 29-May-2009; LatestRevisionNote: IPC-7351 Footprint Added.; PackageReference: C1206; Publisher: Altium Limited; PackageDescription: Chip Capacitor; Supplier 1: Digi-Key; Supplier Part Number 1: 587-3807-1-ND; Supplier 2: Digi-Key; Supplier Part Number 2: 490-7998-1-ND; Stock 2: 5962647; Pricing 2: 1=0.1, 10=0.058, 100=0.026, 500=0.01858, 1000=0.0146, 2500=0.01328, 5000=0.01221 (USD); Mount: Surface Mount; Case/Package: 0402; Case Code (Imperial): 0402; Case Code (Metric): 1005; Min Operating Temperature: -55°C; Max Operating Temperature: 125°C; Voltage Rating (DC): 16V; Packaging: Tape and Reel; Package Quantity: 1; Termination: SMD/SMT; Length: 1mm; Height: 0.5mm; Width: 0.5mm; Thickness: 0.022inch; Depth: 0.5mm; Ratings: AEC-Q200; Radiation Hardening: No; Lead Free: Lead Free; ComponentLink1URL: http://psearch.murata.com/capacitor/product/GCM155R71C104KA55%23.pdf?src-supplier=Avnet; ComponentLink1Description: http://psearch.murata.com/capacitor/product/GCM155R71C104KA55%23.pdf?src-supplier=Avnet; ComponentLink2URL: http://www1.futureelectronics.com/doc/MURATA/GCM155R71C104KA55J.pdf?src-supplier=Future+Electronics; ComponentLink2Description: http://www1.futureelectronics.com/doc/MURATA/GCM155R71C104KA55J.pdf?src-supplier=Future+Electronics; ComponentLink3URL: http://psearch.en.murata.com/capacitor/product/GCM155R71C104KA55%23.pdf?src-supplier=Digi-Key; ComponentLink3Description: http://psearch.en.murata.com/capacitor/product/GCM155R71C104KA55%23.pdf?src-supplier=Digi-Key; ComponentLink4URL: http://search.murata.co.jp/Ceramy/image/img/A01X/partnumbering_e_02.pdf?src-supplier=Digi-Key; ComponentLink4Description: http://search.murata.co.jp/Ceramy/image/img/A01X/partnumbering_e_02.pdf?src-supplier=Digi-Key
R32 = Res1: Resistor; Published: 8-Jun-2000; LatestRevisionDate: 17-Jul-2002; LatestRevisionNote: Re-released for DXP Platform.; PackageReference: AXIAL-0.3; Publisher: Altium Limited; PackageDescription: Axial Device, Thru-Hole; 2 Leads; 0.3 in Pin Spacing; Supplier 1: Digi-Key
R33-R38 = Res1: as R27 on sheet Power; Published: 8-Jun-2000; LatestRevisionDate: 17-Jul-2002; LatestRevisionNote: Re-released for DXP Platform.; PackageReference: AXIAL-0.3; Publisher: Altium Limited; PackageDescription: Axial Device, Thru-Hole; 2 Leads; 0.3 in Pin Spacing; Supplier 1: Digi-Key; Supplier 2: Digi-Key; Supplier Part Number 2: P0.0JCT-ND; Stock 2: 51531353; Pricing 2: 1=0.1, 10=0.03, 25=0.0216, 50=0.0164, 100=0.0121, 250=0.00924, 500=0.0074, 1000=0.00545, 5000=0.00391 (USD); Mount: Surface Mount; Case/Package: 0402; Case Code (Metric): 1005; Case Code (Imperial): 0402; Contact Plating: Tin; Min Operating Temperature: -55°C; Max Operating Temperature: 155°C; Packaging: Tape and Reel; Package Quantity: 1; Composition: Thick Film; Number of Terminations: 2; Termination: SMD/SMT; Military Standard: Not; Max Power Dissipation: 100mW; Voltage Rating (DC): 50V; Features: Automotive AEC-Q200; Length: 1mm; Height: 0.35mm; Width: 0.02inch; Depth: 0.5mm; Radiation Hardening: No; REACH SVHC: No SVHC; Lead Free: Lead Free; ComponentLink1URL: http://industrial.panasonic.com/www-data/pdf/AOA0000/AOA0000CE1.pdf?src-supplier=Avnet; ComponentLink1Description: http://industrial.panasonic.com/www-data/pdf/AOA0000/AOA0000CE1.pdf?src-supplier=Avnet; ComponentLink2URL: http://www.alliedelec.com/m/d/51cd0790071e1666bdb9d00c57fcf960.pdf?src-supplier=Allied+Electronics; ComponentLink2Description: http://www.alliedelec.com/m/d/51cd0790071e1666bdb9d00c57fcf960.pdf?src-supplier=Allied+Electronics; ComponentLink3URL: http://industrial.panasonic.com/www-data/pdf/AOA0000/AOA0000CE1.pdf?src-supplier=Avnet+Europe; ComponentLink3Description: http://industrial.panasonic.com/www-data/pdf/AOA0000/AOA0000CE1.pdf?src-supplier=Avnet+Europe; ComponentLink4URL: http://www.farnell.com/datasheets/2059623.pdf?src-supplier=Farnell; ComponentLink4Description: http://www.farnell.com/datasheets/2059623.pdf?src-supplier=Farnell; ComponentLink5URL: http://www.farnell.com/datasheets/1678796.pdf?src-supplier=Element14; ComponentLink5Description: http://www.farnell.com/datasheets/1678796.pdf?src-supplier=Element14; ComponentLink6URL: http://www.farnell.com/datasheets/2059623.pdf?src-supplier=Element14; ComponentLink6Description: http://www.farnell.com/datasheets/2059623.pdf?src-supplier=Element14
U5 = MCP23017-QFN: Supplier 1: Digi-Key